# EAGLE design mixer_bolock (EAGLE 9.6.2)
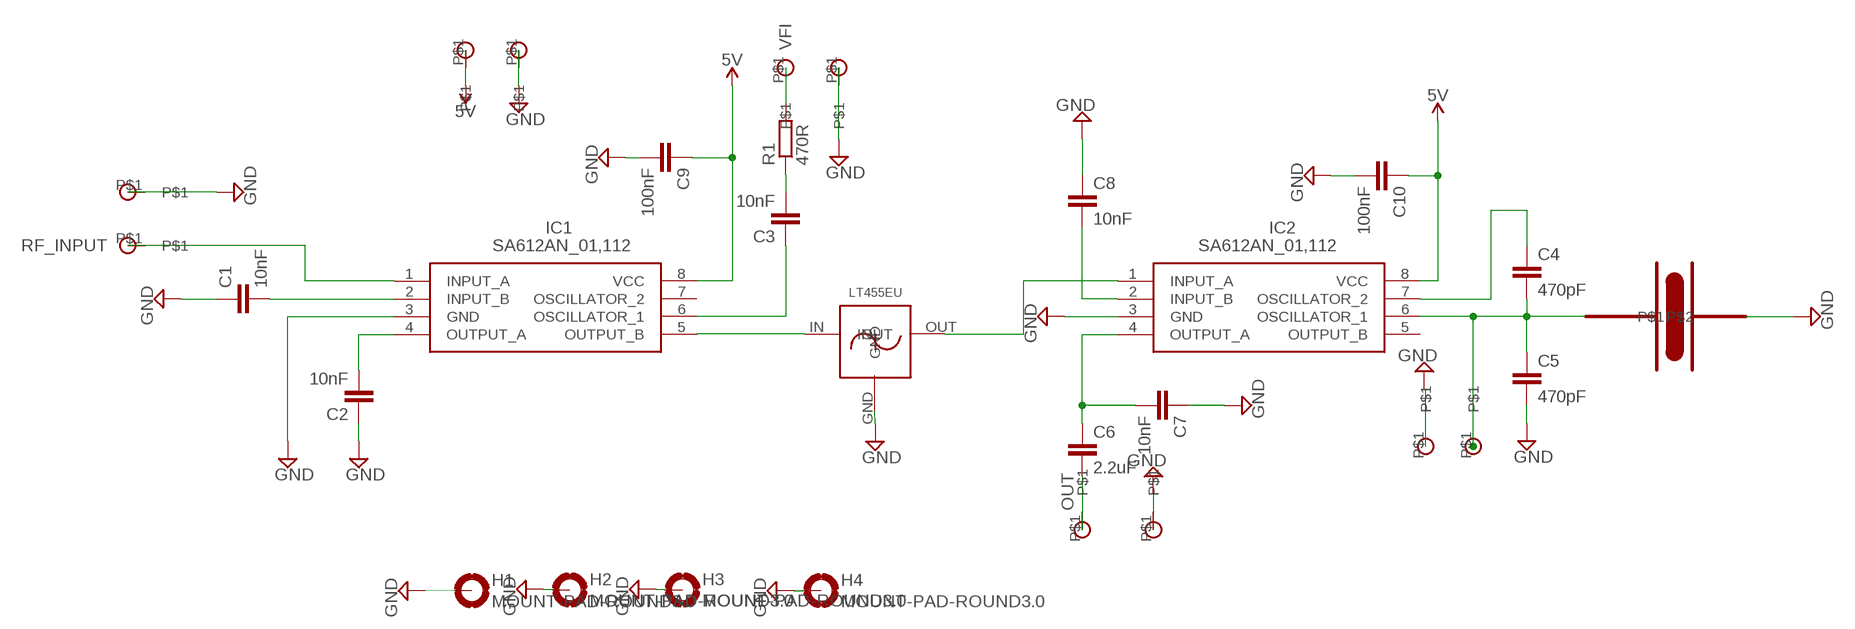
[diagram p0: schematic, sheet 1]

## Parts
+5  SMD_PIN  [SMD_PIN]
BFI  SMD_PIN  [SMD_PIN]
C1  10nF  C-EUC0805K  [C0805K]
C2  10nF  C-EUC0805K  [C0805K]
C3  10nF  C-EUC0805K  [C0805K]
C4  470pF  C-EUC0805K  [C0805K]
C5  470pF  C-EUC0805K  [C0805K]
C6  2.2uF  C-EU050-050X075  [C050-050X075]
C7  10nF  C-EUC0805K  [C0805K]
C8  10nF  C-EUC0805K  [C0805K]
C9  100nF  C-EUC0805K  [C0805K]
C10  100nF  C-EUC0805K  [C0805K]
H1  MOUNT-PAD-ROUND3.0  [3,0-PAD]
H2  MOUNT-PAD-ROUND3.0  [3,0-PAD]
H3  MOUNT-PAD-ROUND3.0  [3,0-PAD]
H4  MOUNT-PAD-ROUND3.0  [3,0-PAD]
IC1  SA612AN_01,112  [DIP762W53P254L950H420Q8N]
IC2  SA612AN_01,112  [DIP762W53P254L950H420Q8N]
IN  SMD_PIN  [SMD_PIN]
OUT  SMD_PIN  [SMD_PIN]
R1  470R  R-EU_R0805  [R0805]
U$1  ZTBF455E  [ZTBF455E]
U$2  SMD_PIN  [SMD_PIN]
U$4  SMD_PIN  [SMD_PIN]
U$5  SMD_PIN  [SMD_PIN]
U$6  SMD_PIN  [SMD_PIN]
U$7  SMD_PIN  [SMD_PIN]
U$9  LT455EU  [LT455EU]
VFI  SMD_PIN  [SMD_PIN]

## Nets
5V: +5.P$1 C9.1 C10.1 IC1.8(VCC) IC2.8(VCC)
BFI: BFI.P$1 C4.2 C5.1 IC2.6(OSCILLATOR_1) U$1.P$1
GND: C1.1 C2.1 C5.2 C7.1 C8.1 C9.2 C10.2 H1.B3,0(MOUNT) H2.B3,0(MOUNT) H3.B3,0(MOUNT) H4.B3,0(MOUNT) IC1.3(GND) IC2.3(GND) U$1.P$2 U$2.P$1 U$4.P$1 U$5.P$1 U$6.P$1 U$7.P$1 U$9.GND
N$1: C1.2 IC1.2(INPUT_B)
N$3: IC2.1(INPUT_A) U$9.OUT
N$4: C2.2 IC1.4(OUTPUT_A)
N$5: C3.2 R1.1
N$6: C3.1 IC1.6(OSCILLATOR_1)
N$8: C4.1 IC2.7(OSCILLATOR_2)
N$10: C6.1 C7.2 IC2.4(OUTPUT_A)
N$11: C8.2 IC2.2(INPUT_B)
N$12: IC1.5(OUTPUT_B) U$9.IN
OUT: C6.2 OUT.P$1
RF_INPUT: IC1.1(INPUT_A) IN.P$1
VFI: R1.2 VFI.P$1
Unconnected: IC1.7(OSCILLATOR_2) IC2.5(OUTPUT_B)

## Library data of the parts
+5 BFI IN OUT U$2 U$4-U$7 VFI = mylib:SMD_PIN
C1-C10 = rcl:C-EU: CAPACITOR, European symbol; SPICEPREFIX: C
H1-H4 = holes:MOUNT-PAD-ROUND: MOUNTING PAD, round
IC1 IC2 = SA612AN_01_112:SA612AN_01,112: NXP SA612AN, Mixer Circuit Gain=17 dB 4.5 8 V 8-Pin PDIP Source: Datasheet <https://datasheet.datasheetarchive.com/originals/distributors/Datasheets_SAMA/f801acdc6cb9d9748f3d91798dd5a70c.pdf>; DESCRIPTION: NXP SA612AN, Mixer Circuit Gain=17 dB 4.5 8 V 8-Pin PDIP; HEIGHT: 4.2mm; MANUFACTURER_NAME: Nexperia; MANUFACTURER_PART_NUMBER: SA612AN/01,112; MOUSER_PART_NUMBER: 771-SA612AN/01; MOUSER_PRICE-STOCK: https://www.mouser.com/Search/Refine.aspx?Keyword=771-SA612AN%2F01
R1 = rcl:R-EU_: RESISTOR, European symbol; SPICEPREFIX: R
U$1 = mylib:ZTBF455E
U$9 = mylib:LT455EU

## Board
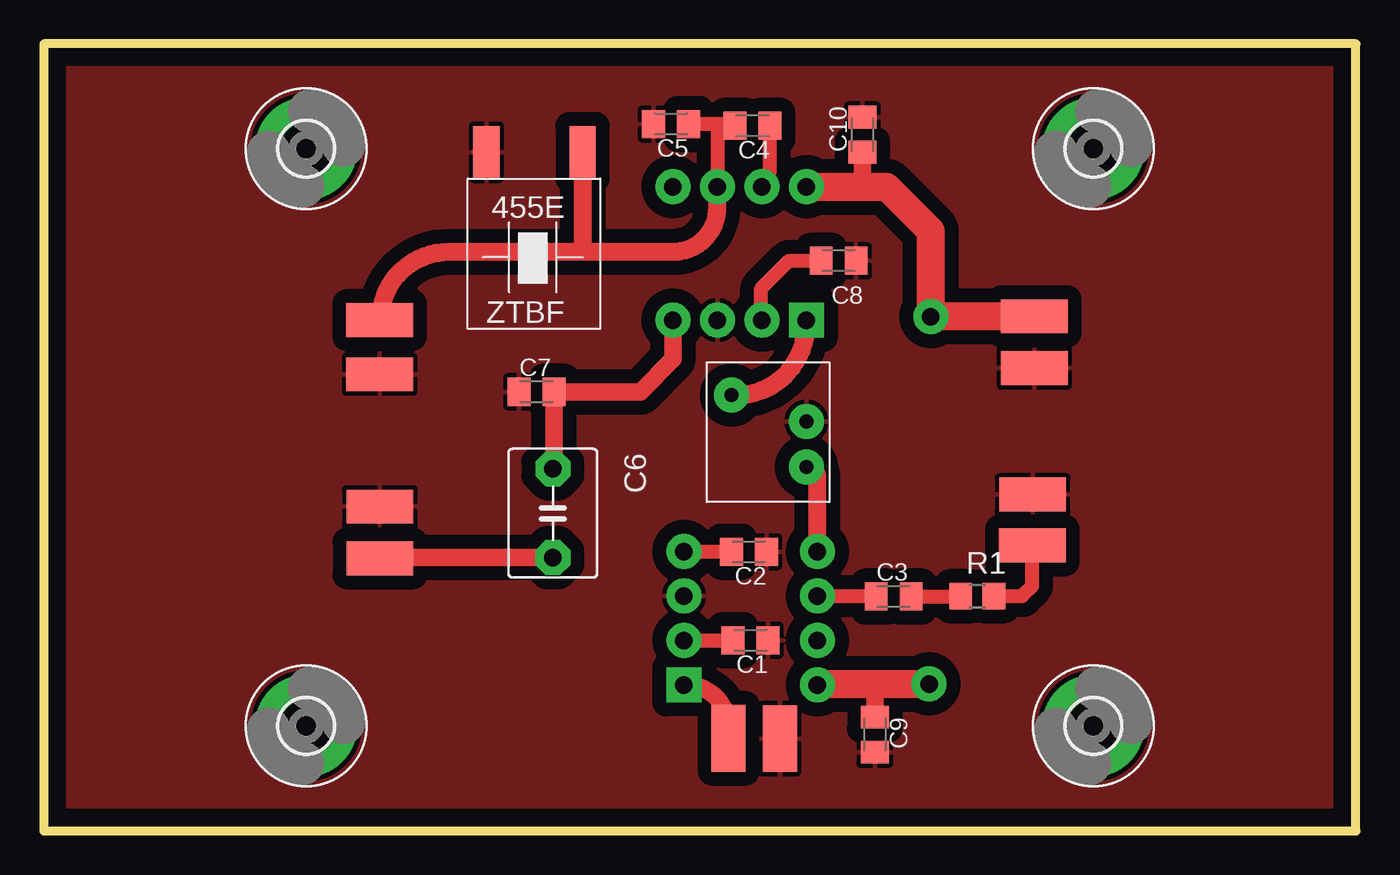
[diagram p1: board, top side]
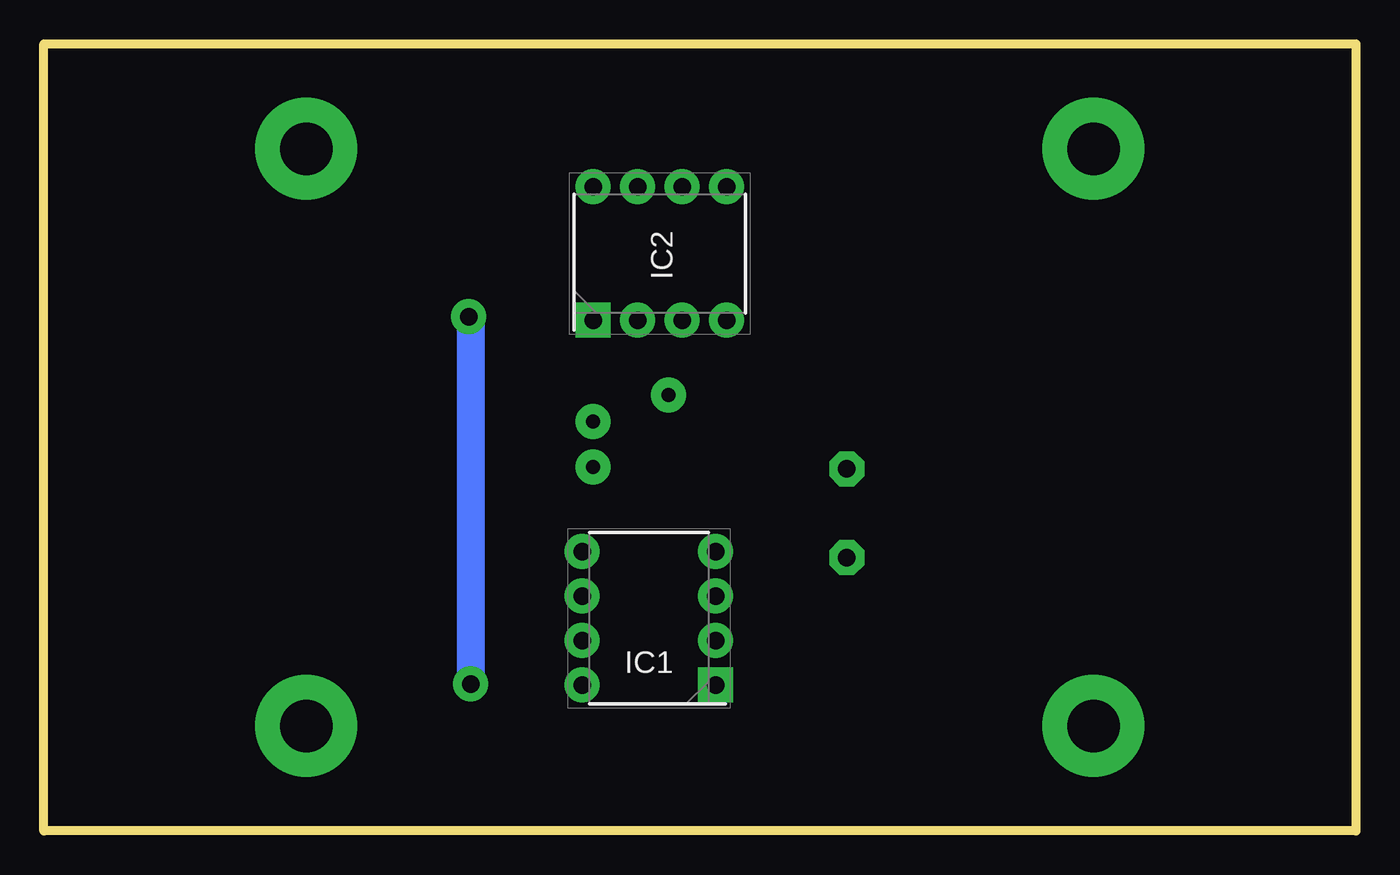
[diagram p2: board, bottom side, seen from below]

Size 75 x 45 mm. Coordinates in mm from the lower left corner, seen from the top.
Outline: 0,0 75,0 75,45 0,45 0,0
Copper layers (1*16): Top 0.035mm / dielectric 1.5mm / Bottom 0.035mm
Design rules "default": minimum track width 6mil, minimum drill 0.35mm, track to track 6mil, track to pad 6mil, pad to pad 6mil, via to via 6mil, smd to smd 6mil, copper to edge 40mil, drill to drill 6mil, minimum pad ring 10mil, minimum via ring 8mil, stop-mask expansion 4mil, vias tented up to drill 0mil, thermal gap 10mil

### Footprints (pad centres in the part's own frame; a part is rotated, then mirrored left to right if it is on the bottom)
SMD_PIN = smd 1.93 x 3.81: P$1 0,0
C0805K = smd 1.3 x 1.6: 1 -1,0; 2 1,0
C050-050X075 = drill 1 pad 2 octagon: 1 -2.54,0; 2 2.54,0
3,0-PAD = drill 3 pad 5.842: B3,0 0,0
DIP762W53P254L950H420Q8N = drill 1 pad 2 square: 1 -3.81,3.81 | drill 1 pad 2: 2 -3.81,1.27; 3 -3.81,-1.27; 4 -3.81,-3.81; 5 3.81,-3.81; 6 3.81,-1.27; 7 3.81,1.27; 8 3.81,3.81
R0805 = smd 1.3 x 1.5: 1 -0.95,0; 2 0.95,0
ZTBF455E = smd 1.5 x 3: P$1 1,-1.5; P$2 6.5,-1.5
LT455EU = drill 0.8 pad 2: GND 3.4,5.7; IN 6,5.7; OUT 1.9,1.4

### Placement (x,y rotation side)
+5  56.63,29.41 90 top
BFI  19.2,29.2 90 top
C1  40.4,10.9 180 top
C2  40.31,15.95 180 top
C3  48.58,13.4 0 top
C4  40.51,40.31 180 top
C5  35.86,40.41 180 top
C6  29.1,18.16 270 top
C7  28.17,25.1 0 top
C8  45.44,32.6 180 top
C9  47.5,5.5 270 top
C10  46.8,39.8 90 top
H1  15,6 0 top
H2  60,6 0 top
H3  15,39 0 top
H4  60,39 0 top
IC1  40.41,12.15 180 bottom
IC2  39.78,33.01 90 bottom
IN  39.15,5.29 0 top
OUT  19.21,15.57 90 top
R1  53.36,13.42 0 top
U$1  31.8,37.3 180 top
U$2  19.2,26.1 90 top
U$4  19.21,18.53 90 top
U$5  56.53,19.23 90 top
U$6  42.09,5.27 0 top
U$7  56.63,26.45 90 top
U$9  37.9,26.8 270 top
VFI  56.51,16.31 90 top

### Tracks (layer width: path | path; a pad name or v marks a point on that pad's centre or on a via)
5V  (via drill 1 pad 2)
  Top 0.813: IC1.8 44.22,8.4
  Top 1: C10.1 46.8,37.12 46.5,36.82 | C9.1 47.5,8.4
  Top 1.6: v50.6,8.4 47.5,8.4 44.22,8.4 | +5.P$1 v50.7,29.4 50.7,34.3 48.18,36.82 46.5,36.82 IC2.8
  Bottom 1.6: v50.7,29.4 50.6,29.3 v50.6,8.4
BFI
  Top 0.813: IC2.6 38.51,40.31 C4.2 39.41,40.41 C5.1
  Top 1.016: BFI.P$1 19.24,29.2 arc-90 23.14,33.1 30.8,33.1 | IC2.6 38.51,35.64 arc-90 35.97,33.1 30.8,33.1 | U$1.P$1 30.8,33.1
GND
  pour Top (isolate 0.8): -2,46.5 -2,-2 77,-2 77,46.5
N$1
  Top 0.813: IC1.2 arc-90 36.62,10.9 C1.2
N$3
  Top 1.016: U$9.OUT 39.55,24.9 arc90 43.59,28.94 IC2.1
N$4
  Top 0.813: IC1.4 C2.2 arc-90 C2.2
N$5
  Top 0.813: C3.2 52.39,13.4 R1.1
N$6
  Top 0.813: IC1.6 44.24,13.4 C3.1
N$8
  Top 0.813: IC2.7 41.05,37.25 41.51,37.71 C4.1
N$10
  Top 0.813: C7.2 arc-90 29.2,25.07
  Top 1: IC2.4 35.97,26.97 34.1,25.1 C7.2 29.17,20.77 C6.1
N$11
  Top 0.813: IC2.2 41,29.25 41,31 42.6,32.6 C8.2
N$12
  Top 1.016: IC1.5 44.22,20.18 arc90 U$9.IN
OUT
  Top 1: C6.2 19.24,15.62 19.21,15.59 OUT.P$1
RF_INPUT
  Top 1: IN.P$1 39.15,5.9 arc90 36.71,8.34 IC1.1
VFI
  Top 0.813: VFI.P$1 56.51,14.01 55.92,13.42 R1.2